# Altium project MainBoard.PrjPcb (part 2 of 2)

## Sheet KEYBOARD.SchDoc: KEYBOARD
size A4; Date: 30 08 2013; Author: Rachid AKKOUCHE; CompanyName: RASoftware; DrawnBy: Rachid AKKOUCHE; Organization: RASoftware; Address1: 52 J03, rue de la crèche; Address2: 77100 MEAUX; Address3: FRANCE; DocumentNumber: BRA201308306C; Revision: C; SheetNumber: 4; SheetTotal: 4; Telephone: +33651604047; Email: rachid.akkouche@wanadoo.fr; Proprietaire: MDI System; Dessinepar: -; Verifiepar: -; Property: RASoftware; Time: 19:00
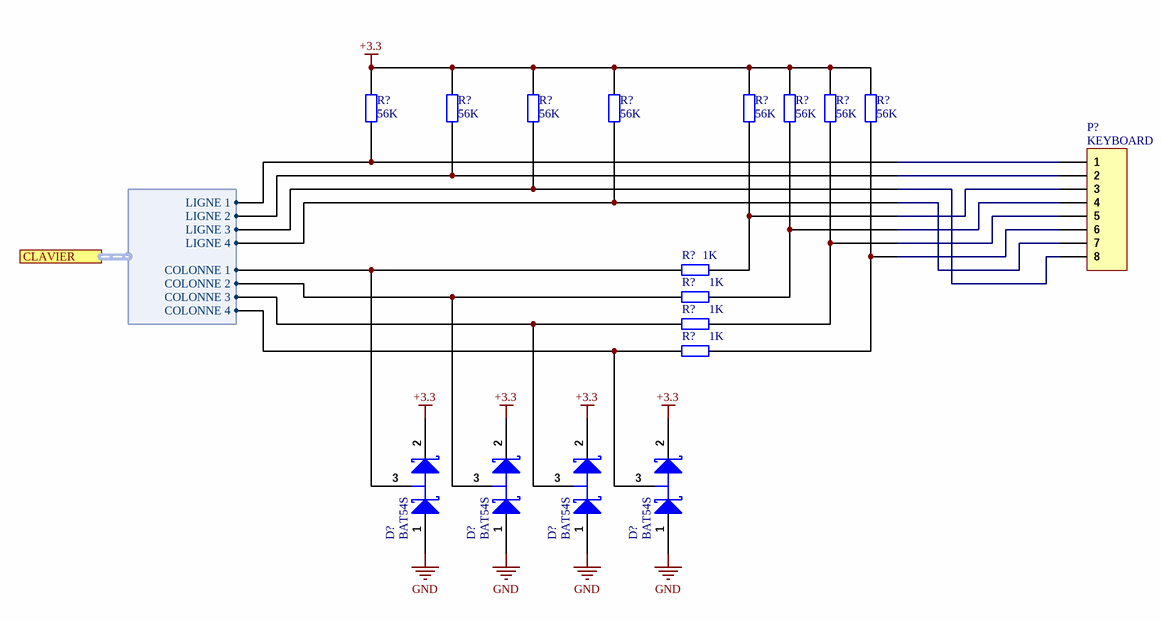
[diagram p3: KEYBOARD.SchDoc]

### Parts
(Parts that share a designator on the sheet are numbered #1, #2 ... from top to bottom, then left to right.)
D?#7  BAT54S  [SOT-23]
D?#8  BAT54S  [SOT-23]
D?#9  BAT54S  [SOT-23]
D?#10  BAT54S  [SOT-23]
P?#5  KEYBOARD  [M20_1X8]
R?#40  56K  [R0805]
R?#41  56K  [R0805]
R?#42  56K  [R0805]
R?#43  56K  [R0805]
R?#44  56K  [R0805]
R?#45  56K  [R0805]
R?#46  56K  [R0805]
R?#47  56K  [R0805]
R?#48  1K  [R0805]
R?#49  1K  [R0805]
R?#50  1K  [R0805]
R?#51  1K  [R0805]

### Ports
CLAVIER (harness KEYBOARD)

### Harnesses
KEYBOARD: COLONNE 1, COLONNE 2, COLONNE 3, COLONNE 4, LIGNE 1, LIGNE 2, LIGNE 3, LIGNE 4

### Nets
+3.3: D?#7.2(K) D?#8.2(K) D?#9.2(K) D?#10.2(K) R?#40.1 R?#41.1 R?#42.1 R?#43.1 R?#44.1 R?#45.1 R?#46.1 R?#47.1
GND: D?#7.1(A) D?#8.1(A) D?#9.1(A) D?#10.1(A)
NetD?#7_3: D?#7.3(C) R?#48.2 ; port CLAVIER.COLONNE 1
NetD?#8_3: D?#8.3(C) R?#49.2 ; port CLAVIER.COLONNE 2
NetD?#9_3: D?#9.3(C) R?#50.2 ; port CLAVIER.COLONNE 3
NetD?#10_3: D?#10.3(C) R?#51.2 ; port CLAVIER.COLONNE 4
NetP?#5_1: P?#5.1 R?#40.2 ; port CLAVIER.LIGNE 1
NetP?#5_2: P?#5.2 R?#41.2 ; port CLAVIER.LIGNE 2
NetP?#5_3: P?#5.3 R?#44.2 R?#48.1
NetP?#5_4: P?#5.4 R?#45.2 R?#49.1
NetP?#5_5: P?#5.5 R?#46.2 R?#50.1
NetP?#5_6: P?#5.6 R?#47.2 R?#51.1
NetP?#5_7: P?#5.7 R?#43.2 ; port CLAVIER.LIGNE 4
NetP?#5_8: P?#5.8 R?#42.2 ; port CLAVIER.LIGNE 3

### Notes on the sheet
- Ce document est la propriété de
- Project:
- Il ne peut être divulgué sans l'accord écrit de l'un de ses représentants dûment mandaté
- Title:
- Number:
- Date:
- Time:
- Size:
- A4
- Revision:
- Sheet
- of
- 52 J03 rue de la crèche
- Draw by:
- 77100 Meaux

### Library data of the parts
D?#7-D?#10 = BAT54S: Schottky Barrier Double Diode; Manufacturer: MULTICOMP; Published: 17-Sep-2003; LatestRevisionDate: 12-Dec-2006; LatestRevisionNote: IPC-7351 Footprint Added.; DatasheetVersion: 4-Mar-2002; PackageVersion: May-1999; PackageReference: SOT23; Publisher: Altium Limited; PackageDescription: 3-Pin SOT-23 Package 0.95 mm Pitch, 2.3 mm Lead Span; ComponentLink1Description: Manufacturer Link; ComponentLink1URL: http://www.semiconductors.philips.com/; ComponentLink2Description: Datasheet; ComponentLink2URL: http://www.semiconductors.philips.com/acrobat/datasheets/BAT54_SERIES_4.pdf; Supplier 1: Farnell; Supplier Part Number 1: 1621835; Manufacturer Part Number: BAT54S; RoHS: YES; Stock 1: 51548; Pricing 1: 10=0,102, 250=0,074, 1000=0,06, 3000=0,053 (EUR); ComponentLink3URL: http://www.farnell.com/datasheets/1317753.pdf; ComponentLink3Description: http://www.farnell.com/datasheets/1317753.pdf
P?#5 = Header 8: Header, 8-Pin; Manufacturer: HARWIN; Manufacturer Part Number: M20-8770842; LatestRevisionDate: 17-Jul-2002; LatestRevisionNote: Re-released for DXP Platform.; Publisher: Altium Limited; Supplier 1: Farnell; Supplier Part Number 1: 1517385; RoHS: YES; Pricing 1: 10=0,9, 20=0,86, 50=0,8, 100=0,77, 250=0,75, 500=0,71 (EUR); ComponentLink1URL: http://www.farnell.com/datasheets/1089525.pdf; ComponentLink1Description: http://www.farnell.com/datasheets/1089525.pdf; ComponentLink2URL: http://www.farnell.com/datasheets/5481.pdf; ComponentLink2Description: http://www.farnell.com/datasheets/5481.pdf
R?#40-R?#47 = Resistor 0805 56K: Resistor; Manufacturer: MULTICOMP; Manufacturer Part Number: MC0.1W08051%56KFR; Product Range: MULTICOMP - MC Series; Résistance: 56; Puissance: 100; Tolérance de résistance: ± 1%; Type de boîtier de résistance: 0805; Type de résistance: Couche épaisse; Coefficient de température: ± 100; Tension: 150; Type de packaging: Full Reel; Resistor Mounting: CMS; Resistor Terminals: (Non Disponible); Supplier 1: Farnell; RoHS: YES; Pricing 1: 5000=0,001 (EUR); MSL: (Non Applicable); ComponentLink1URL: http://www.farnell.com/datasheets/1716700.pdf; ComponentLink1Description: http://www.farnell.com/datasheets/1716700.pdf; Supplier Part Number 1: 2129258
R?#48-R?#51 = Resistor 0805 1K: Resistor; Manufacturer: MULTICOMP; Manufacturer Part Number: MC0.1W08051%1KFR; Product Range: MULTICOMP - MC Series; Résistance: 1; Puissance: 100; Tolérance de résistance: ± 1%; Type de boîtier de résistance: 0805; Type de résistance: Couche épaisse; Coefficient de température: ± 100; Tension: 150; Type de packaging: Full Reel; Resistor Mounting: CMS; Supplier 1: Farnell; RoHS: YES; Pricing 1: 5000=0,001 (EUR); MSL: MSL 1 - Illimité; ComponentLink1URL: http://www.farnell.com/datasheets/1716700.pdf; ComponentLink1Description: http://www.farnell.com/datasheets/1716700.pdf; Supplier Part Number 1: 2129113

## Nets that join several sheets
3.3V: PSU (6 pins), AFFICHEUR (14 pins)
5V: PSU (6 pins), AFFICHEUR (11 pins)
+3.3: MDB (R?#35.1), KEYBOARD (12 pins)
GND: PSU (17 pins), AFFICHEUR (P?#2.4 PT?.1 R?#18.1 R?#21.1), MDB (11 pins), KEYBOARD (D?#7.1 D?#8.1 D?#9.1 D?#10.1)